# Altium schematic sheet Sheet_LVTN.schdoc
size 351 x 207 mm
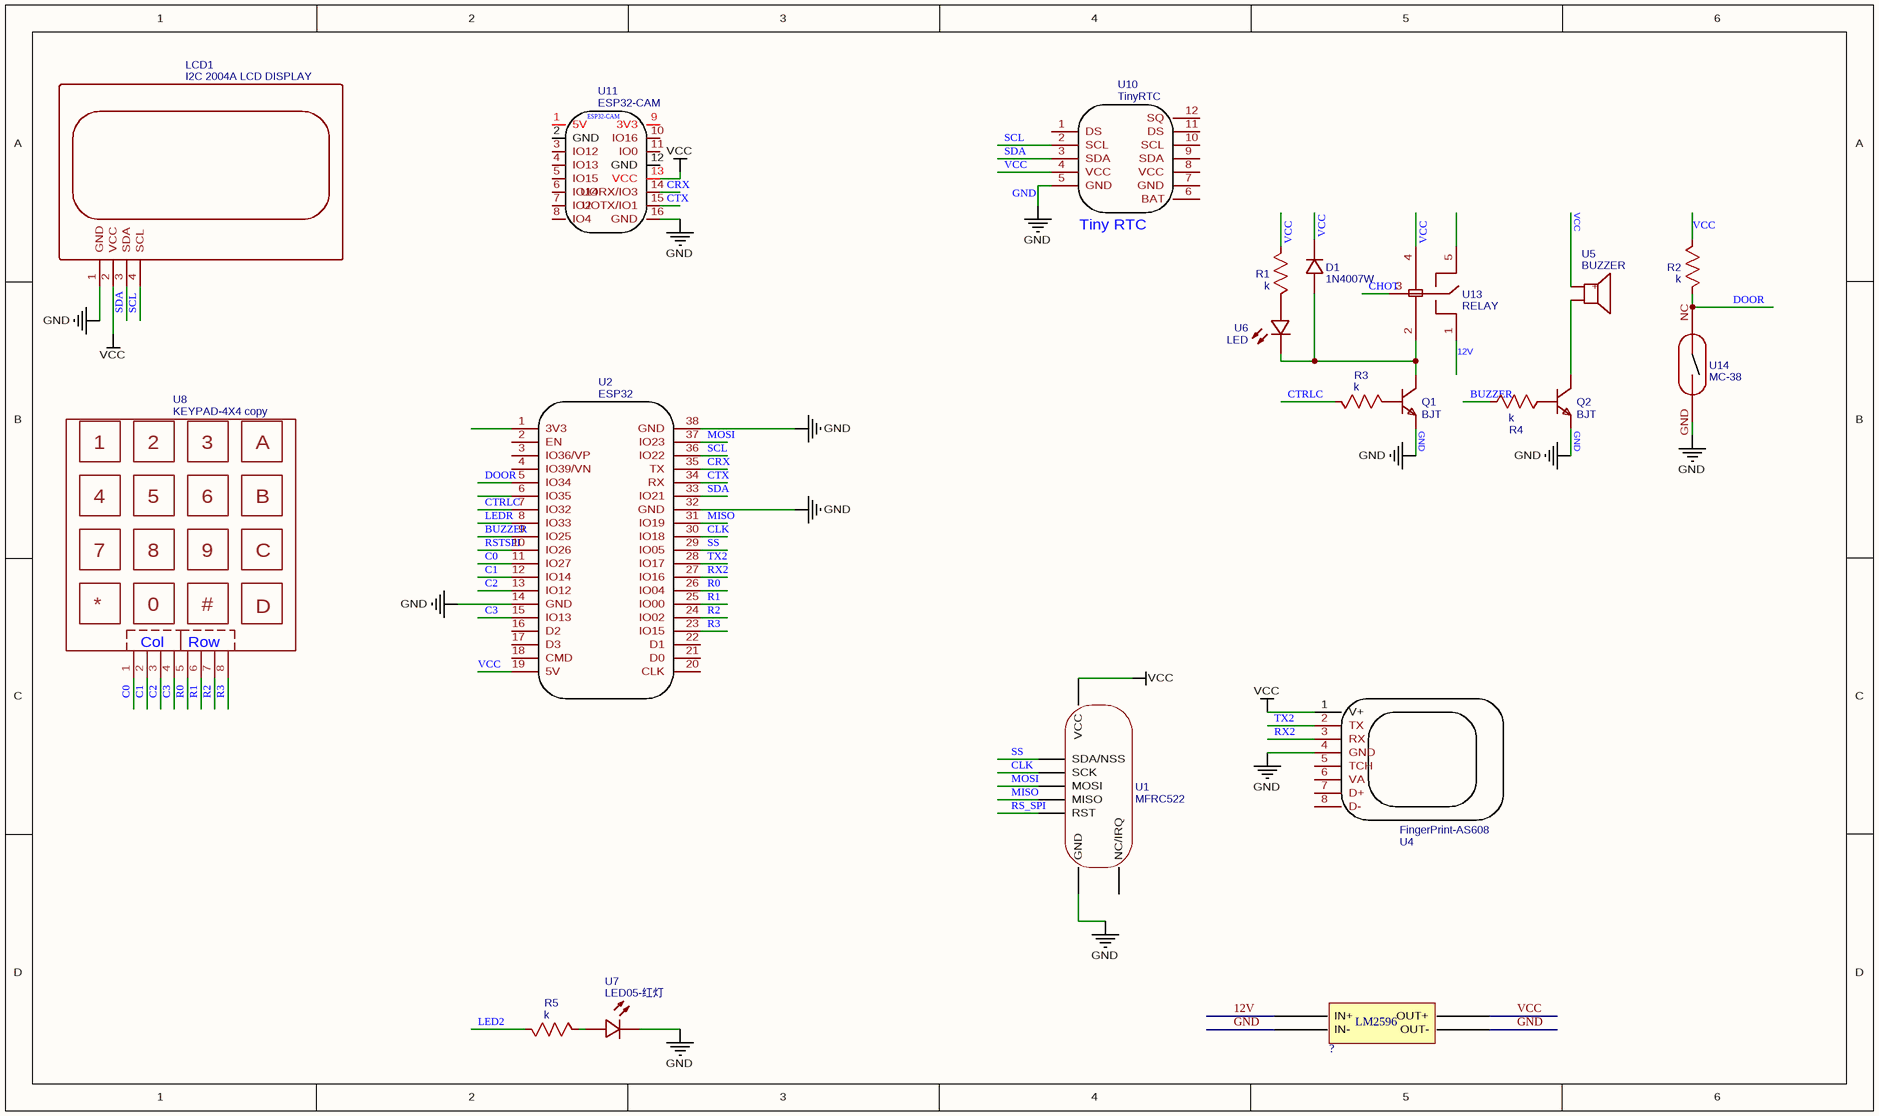
[diagram p0: Sheet_LVTN.schdoc]

## Parts
?  BUCK_LM2596  [BUCK_LM2596]  (value not drawn)
D1  1N4007W  [SOD-123_L2.8-W1.8-LS3.7-RD]
LCD1  I2C 2004A LCD DISPLAY  [LCD2004]
Q1  BJT  [TO-92-3_L4.9-W3.7-P2.54-L]
Q2  BJT  [TO-92-3_L4.9-W3.7-P2.54-L]
R1  k  [R0603]
R2  k  [R0603]
R3  k  [R0603]
R4  k  [R0603]
R5  k  [R0603]
U1  MFRC522  [MFRC522]
U2  ESP32  [ESP32-WROOM-32-D-U-DEVKIT]
U4  FingerPrint-AS608  [SIL-6]
U5  BUZZER  [BUZ-SMD_BUZZER]
U6  LED  [LED-TH_LED-3MM_RED]
U7  LED05-红灯  [LED-TH_LED-3MM_RED]
U8  KEYPAD-4X4 copy  [KEYPAD4X4]
U10  TinyRTC  [TINYRTC]
U11  ESP32-CAM  [ESP32-CAM]
U13  RELAY  [RELAY-TH_RELAY-SPST]
U14  MC-38  [NONE]

## Nets
GND: ?.2(IN-) ?.3(OUT-) LCD1.1(GND) Q1.1(E) Q2.1(E) U1.6(GND) U2.14(GND) U2.32(GND) U2.38(GND) U4.4(GND) U7.2 U10.5(GND) U11.16(GND) U14.GND
VCC: ?.4(OUT+) D1.1 LCD1.2(VCC) R1.1 R2.1 U1.8(VCC) U2.19(5V) U4.1(V+) U10.4(VCC) U11.13(VCC) U13.4
12V: ?.1(IN+)
BUZZER: R4.2 U2.9(IO25)
C0: U2.11(IO27) U8.1(OUT4)
C1: U2.12(IO14) U8.2(OUT3)
C2: U2.13(IO12) U8.3(OUT2)
C3: U2.15(IO13) U8.4(OUT1)
CHOT: U13.3
CLK: U1.3(SCK) U2.30(IO18)
CRX: U2.35(TX) U11.14(UORX/IO3)
CTRLC: R3.2 U2.7(IO32)
CTX: U2.34(RX) U11.15(UOTX/IO1)
DOOR: R2.2 U2.5(IO34) U14.NC
LED2: R5.2
LEDR: U2.8(IO33)
MISO: U1.5(MISO) U2.31(IO19)
MOSI: U1.4(MOSI) U2.37(IO23)
R0: U2.26(IO04) U8.5(SDO)
R1: U2.25(IO00) U8.6(SCL)
R2: U2.24(IO02) U8.7(GND)
R3: U2.23(IO15) U8.8(VCC)
RS_SPI: U1.7(RST)
RSTSPI: U2.10(IO26)
RX2: U2.27(IO16) U4.3(RX)
SCL: LCD1.4(SCL) U2.36(IO22) U10.2(SCL)
SDA: LCD1.3(SDA) U2.33(IO21) U10.3(SDA)
SS: U1.2(SDA/NSS) U2.29(IO05)
TX2: U2.28(IO17) U4.2(TX)
NetD1_2: D1.2 Q1.2(C) U6.2 U13.2
NetQ1_3: Q1.3(B) R3.1
NetQ2_2: Q2.2(C) U5.1
NetQ2_3: Q2.3(B) R4.1
NetR1_2: R1.2 U6.1
NetR5_1: R5.1 U7.1

Not connected (* = marked no-connect by the designer): U1 1(NC/IRQ); U2 1(3V3) 2(EN) 3(IO36/VP) 4(IO39/VN) 6(IO35) 16(D2) 17(D3) 18(CMD) 20(CLK) 21(D0) 22(D1); U4 5(TCH) 6(VA) 7(D+) 8(D-); U5 2(+); U10 1(DS) 6(BAT) 7(GND) 8(VCC) 9(SDA) 10(SCL) 11(DS) 12(SQ); U11 1(5V) 2(GND) 3(IO12) 4(IO13) 5(IO15) 6(IO14) 7(IO2) 8(IO4) 9(3V3) 10(IO16) 11(IO0) 12(GND); U13 1 5

## Notes on the sheet
- VCC
- 12V
- (near Q1) GND
- (near Q2) GND
- (in symbol BUCK_LM2596) LM2596
- (in symbol KEYPAD-4X4 copy) A; B; 9; C; 0; #; D; Col; Row
- (in symbol TinyRTC) Tiny RTC

## Library data of the parts
D1 = 1N4007W: BOM_Manufacturer: BLUE ROCKET; Contributor: LCEDA_Lib; BOM_Supplier: LCSC; BOM_Supplier Part: C328592; BOM_Manufacturer Part: 1N4007W; spicePre: D; spiceSymbolName: 1N4007W
LCD1 = I2C 2004A LCD DISPLAY: BOM_Manufacturer: LONTECH; BOM_Manufacturer Part: LCM1602K-NSW-BBW; Contributor: Александр Юкин; BOM_Supplier Part: C83275; spicePre: L; spiceSymbolName: I2C 2004A LCD DISPLAY
Q1 Q2 = BJT: BOM_Manufacturer: UTC(友顺); BOM_Manufacturer Part: 2SC1815L-GR-T92-B; BOM_Supplier: LCSC; BOM_Supplier Part: C73309; BOM_JLCPCB Part Class: Extended Part; spicePre: Q; spiceSymbolName: 2SC1815L-GR-T92-B
R1-R5 = k: nameAlias: Value(Ω); Contributor: LCEDA_Lib; spicePre: R; spiceSymbolName: R_0603_US
U1 = MFRC522: IC_description: RFID Reader; QR: 0; Contributor: Tyrolight; UID: IC_92; Name: MFRC522; ComponentLink1URL: REF!; mounting: THT; spicePre: U; spiceSymbolName: MFRC522
U2 = ESP32: Contributor: Zambiorix; spicePre: U; spiceSymbolName: ESP32-WROOM-32-D-U-DEVKIT
U4 = FingerPrint-AS608: BOM_Manufacturer Part: AS-608; Contributor: maga_ataev; spicePre: U; spiceSymbolName: FingerPrint-AS608
U5 = BUZZER: BOM_Manufacturer: null; Contributor: lcsc; BOM_Supplier: LCSC; BOM_Supplier Part: C9900021864; BOM_Manufacturer Part: BUZZER; BOM_JLCPCB Part Class: Extended Part; spicePre: U; spiceSymbolName: BUZZER_C9900021864
U6 = LED: BOM_Manufacturer: null; BOM_Manufacturer Part: LED05-红灯; Contributor: LCSC; BOM_Supplier: LCSC; BOM_Supplier Part: C9900009041; BOM_JLCPCB Part Class: Extended Part; spicePre: U; spiceSymbolName: LED05-红灯
U7 = LED05-红灯: BOM_Manufacturer: null; Contributor: LCSC; BOM_Supplier: LCSC; BOM_Supplier Part: C9900009041; BOM_Manufacturer Part: LED05-红灯; BOM_JLCPCB Part Class: Extended Part; spicePre: U; spiceSymbolName: LED05-红灯
U8 = KEYPAD-4X4 copy: Contributor: alejandrocesarmerino; spicePre: U; spiceSymbolName: KEYPAD-4X4 copy
U10 = TinyRTC: Contributor: jpcoelho1974; spicePre: U; spiceSymbolName: TinyRTC
U11 = ESP32-CAM: Contributor: gnatyuk.yevg; spicePre: U; spiceSymbolName: ESP32-CAM
U13 = RELAY: BOM_Manufacturer: null; BOM_Manufacturer Part: Relay-SPST; Contributor: LCSC; BOM_Supplier: LCSC; BOM_Supplier Part: C2941249; BOM_JLCPCB Part Class: Extended Part; spicePre: U; spiceSymbolName: RELAY-SPST
U14 = MC-38: BOM_Manufacturer Part: New SchematicLib; Contributor: mpj4; spicePre: U; spiceSymbolName: MC-38